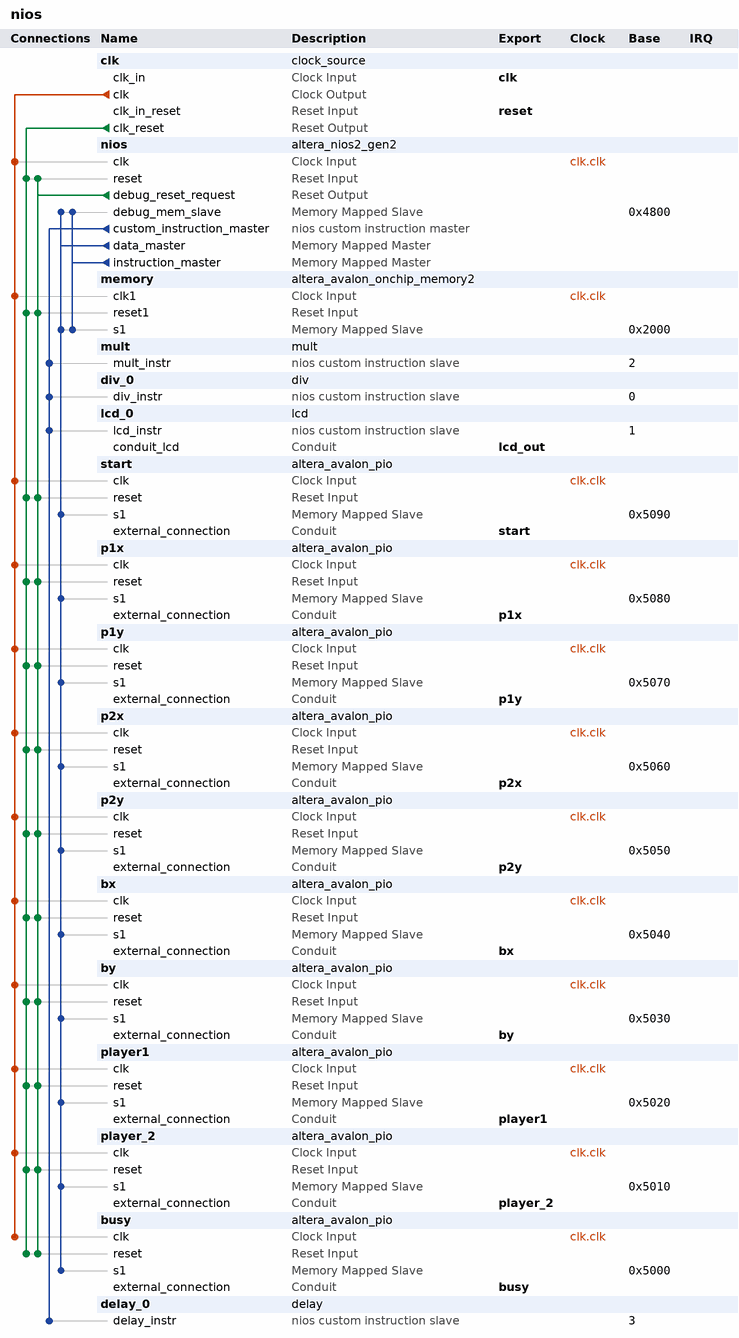
[diagram p0: system contents]
# Platform Designer (Qsys) system nios, Cyclone IV E EP4CE30F23C7
# Parameters at their usual value, and those the tool derives, are not listed.
package require -exact qsys 17.0
create_system nios
set_project_property DEVICE_FAMILY {Cyclone IV E}
set_project_property DEVICE EP4CE30F23C7

add_instance clk clock_source 17.0
set_instance_parameter_value clk clockFrequency 50000000

add_instance nios altera_nios2_gen2 17.0
set_instance_parameter_value nios dcache_size 2048
set_instance_parameter_value nios exceptionSlave memory.s1
set_instance_parameter_value nios icache_size 4096
set_instance_parameter_value nios impl Tiny
set_instance_parameter_value nios resetSlave memory.s1

add_instance memory altera_avalon_onchip_memory2 17.0
set_instance_parameter_value memory dataWidth 32
set_instance_parameter_value memory dualPort false
set_instance_parameter_value memory initMemContent true
set_instance_parameter_value memory initializationFileName pong.hex
set_instance_parameter_value memory memorySize 8192
set_instance_parameter_value memory useNonDefaultInitFile true

add_instance mult mult 1.0

add_instance div_0 div 1.0

add_instance lcd_0 lcd 1.0

add_instance start altera_avalon_pio 17.0
set_instance_parameter_value start direction Input
set_instance_parameter_value start width 1

add_instance p1x altera_avalon_pio 17.0
set_instance_parameter_value p1x direction Output
set_instance_parameter_value p1x width 10

add_instance p1y altera_avalon_pio 17.0
set_instance_parameter_value p1y direction Output
set_instance_parameter_value p1y width 10

add_instance p2x altera_avalon_pio 17.0
set_instance_parameter_value p2x direction Output
set_instance_parameter_value p2x width 10

add_instance p2y altera_avalon_pio 17.0
set_instance_parameter_value p2y direction Output
set_instance_parameter_value p2y width 10

add_instance bx altera_avalon_pio 17.0
set_instance_parameter_value bx direction Output
set_instance_parameter_value bx width 10

add_instance by altera_avalon_pio 17.0
set_instance_parameter_value by direction Output
set_instance_parameter_value by width 10

add_instance player1 altera_avalon_pio 17.0
set_instance_parameter_value player1 direction Input
set_instance_parameter_value player1 width 8

add_instance player_2 altera_avalon_pio 17.0
set_instance_parameter_value player_2 direction Input
set_instance_parameter_value player_2 width 8

add_instance busy altera_avalon_pio 17.0
set_instance_parameter_value busy direction Input
set_instance_parameter_value busy width 1

add_instance delay_0 delay 1.0

# connections
add_connection clk.clk busy.clk clock
add_connection clk.clk bx.clk clock
add_connection clk.clk by.clk clock
add_connection clk.clk memory.clk1 clock
add_connection clk.clk nios.clk clock
add_connection clk.clk p1x.clk clock
add_connection clk.clk p1y.clk clock
add_connection clk.clk p2x.clk clock
add_connection clk.clk p2y.clk clock
add_connection clk.clk player1.clk clock
add_connection clk.clk player_2.clk clock
add_connection clk.clk start.clk clock
add_connection clk.clk_reset busy.reset reset
add_connection clk.clk_reset bx.reset reset
add_connection clk.clk_reset by.reset reset
add_connection clk.clk_reset memory.reset1 reset
add_connection clk.clk_reset nios.reset reset
add_connection clk.clk_reset p1x.reset reset
add_connection clk.clk_reset p1y.reset reset
add_connection clk.clk_reset p2x.reset reset
add_connection clk.clk_reset p2y.reset reset
add_connection clk.clk_reset player1.reset reset
add_connection clk.clk_reset player_2.reset reset
add_connection clk.clk_reset start.reset reset
add_connection nios.debug_reset_request busy.reset reset
add_connection nios.debug_reset_request bx.reset reset
add_connection nios.debug_reset_request by.reset reset
add_connection nios.debug_reset_request memory.reset1 reset
add_connection nios.debug_reset_request nios.reset reset
add_connection nios.debug_reset_request p1x.reset reset
add_connection nios.debug_reset_request p1y.reset reset
add_connection nios.debug_reset_request p2x.reset reset
add_connection nios.debug_reset_request p2y.reset reset
add_connection nios.debug_reset_request player1.reset reset
add_connection nios.debug_reset_request player_2.reset reset
add_connection nios.debug_reset_request start.reset reset
add_connection nios.data_master busy.s1 avalon
set_connection_parameter_value nios.data_master/busy.s1 baseAddress 0x5000
add_connection nios.data_master bx.s1 avalon
set_connection_parameter_value nios.data_master/bx.s1 baseAddress 0x5040
add_connection nios.data_master by.s1 avalon
set_connection_parameter_value nios.data_master/by.s1 baseAddress 0x5030
add_connection nios.data_master memory.s1 avalon
set_connection_parameter_value nios.data_master/memory.s1 baseAddress 0x2000
add_connection nios.data_master nios.debug_mem_slave avalon
set_connection_parameter_value nios.data_master/nios.debug_mem_slave baseAddress 0x4800
add_connection nios.data_master p1x.s1 avalon
set_connection_parameter_value nios.data_master/p1x.s1 baseAddress 0x5080
add_connection nios.data_master p1y.s1 avalon
set_connection_parameter_value nios.data_master/p1y.s1 baseAddress 0x5070
add_connection nios.data_master p2x.s1 avalon
set_connection_parameter_value nios.data_master/p2x.s1 baseAddress 0x5060
add_connection nios.data_master p2y.s1 avalon
set_connection_parameter_value nios.data_master/p2y.s1 baseAddress 0x5050
add_connection nios.data_master player1.s1 avalon
set_connection_parameter_value nios.data_master/player1.s1 baseAddress 0x5020
add_connection nios.data_master player_2.s1 avalon
set_connection_parameter_value nios.data_master/player_2.s1 baseAddress 0x5010
add_connection nios.data_master start.s1 avalon
set_connection_parameter_value nios.data_master/start.s1 baseAddress 0x5090
add_connection nios.instruction_master memory.s1 avalon
set_connection_parameter_value nios.instruction_master/memory.s1 baseAddress 0x2000
add_connection nios.instruction_master nios.debug_mem_slave avalon
set_connection_parameter_value nios.instruction_master/nios.debug_mem_slave baseAddress 0x4800
add_connection nios.custom_instruction_master delay_0.delay_instr nios_custom_instruction
set_connection_parameter_value nios.custom_instruction_master/delay_0.delay_instr CIName delay_0
set_connection_parameter_value nios.custom_instruction_master/delay_0.delay_instr baseAddress 3
add_connection nios.custom_instruction_master div_0.div_instr nios_custom_instruction
set_connection_parameter_value nios.custom_instruction_master/div_0.div_instr CIName div_0
set_connection_parameter_value nios.custom_instruction_master/div_0.div_instr baseAddress 0
add_connection nios.custom_instruction_master lcd_0.lcd_instr nios_custom_instruction
set_connection_parameter_value nios.custom_instruction_master/lcd_0.lcd_instr CIName lcd_0
set_connection_parameter_value nios.custom_instruction_master/lcd_0.lcd_instr baseAddress 1
add_connection nios.custom_instruction_master mult.mult_instr nios_custom_instruction
set_connection_parameter_value nios.custom_instruction_master/mult.mult_instr CIName mult_0
set_connection_parameter_value nios.custom_instruction_master/mult.mult_instr baseAddress 2

# exported interfaces
add_interface busy conduit end
set_interface_property busy EXPORT_OF busy.external_connection
add_interface bx conduit end
set_interface_property bx EXPORT_OF bx.external_connection
add_interface by conduit end
set_interface_property by EXPORT_OF by.external_connection
add_interface clk clock sink
set_interface_property clk EXPORT_OF clk.clk_in
add_interface lcd_out conduit end
set_interface_property lcd_out EXPORT_OF lcd_0.conduit_lcd
add_interface p1x conduit end
set_interface_property p1x EXPORT_OF p1x.external_connection
add_interface p1y conduit end
set_interface_property p1y EXPORT_OF p1y.external_connection
add_interface p2x conduit end
set_interface_property p2x EXPORT_OF p2x.external_connection
add_interface p2y conduit end
set_interface_property p2y EXPORT_OF p2y.external_connection
add_interface player1 conduit end
set_interface_property player1 EXPORT_OF player1.external_connection
add_interface player_2 conduit end
set_interface_property player_2 EXPORT_OF player_2.external_connection
add_interface reset reset sink
set_interface_property reset EXPORT_OF clk.clk_in_reset
add_interface start conduit end
set_interface_property start EXPORT_OF start.external_connection

set_interconnect_requirement {$system} qsys_mm.clockCrossingAdapter HANDSHAKE
set_interconnect_requirement {$system} qsys_mm.enableEccProtection FALSE
set_interconnect_requirement {$system} qsys_mm.insertDefaultSlave FALSE
set_interconnect_requirement {$system} qsys_mm.maxAdditionalLatency 1

save_system nios.qsys
